# Altium schematic sheet XC95144XL DEVBOARD.SchDoc: XC95144XL DEVBOARD
size 420 x 297 mm; ApprovedBy: .; CheckedBy: .; Author: DiWou; CompanyName: DL2DW; DrawnBy: DiWou; Engineer: DiWou; Organization: DL2DW; DocumentNumber: 1; Revision: -; SheetNumber: 1; SheetTotal: 1; DrawnDate: 24.11.2020; EngrDate: .; ChkdDate: .; Title1: XC95144XL DEVBOARD; Title2: .; Title3: .; Desc1: Version 1.0; Desc2: .; ApprDate: .
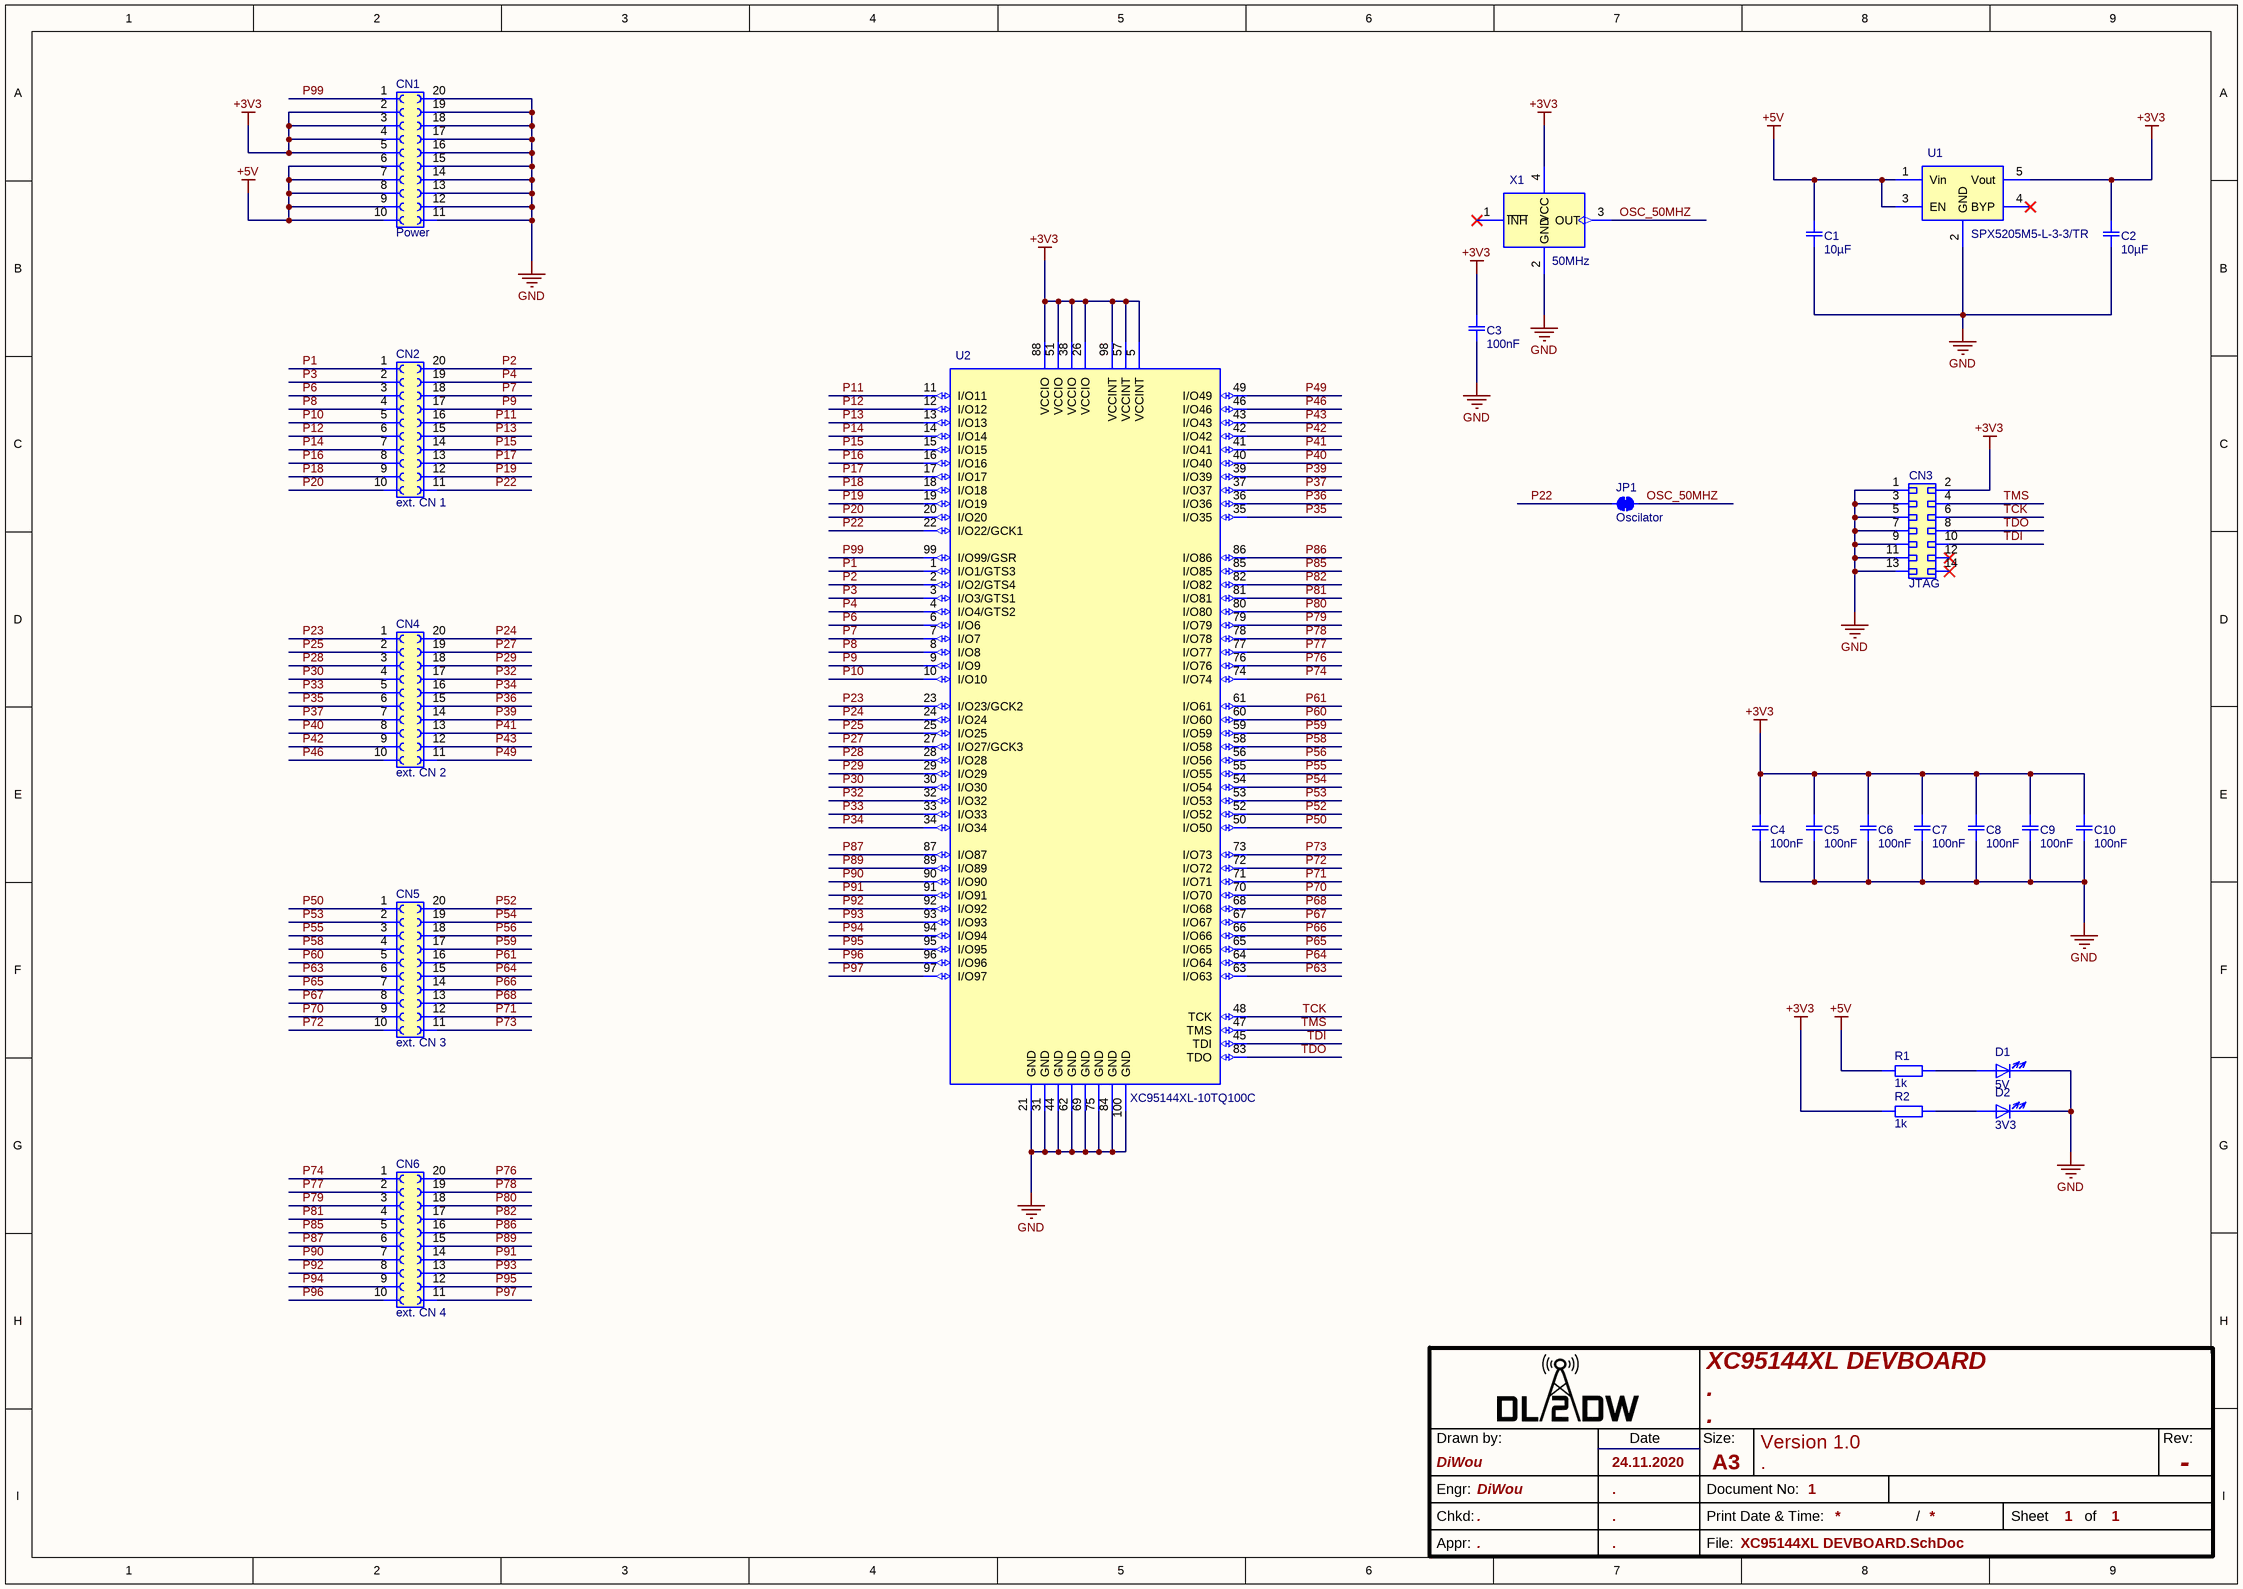
[diagram p0: XC95144XL DEVBOARD.SchDoc]

## Parts
C1  10µF  [Kemet C0805CxxxK8RACTU Series H=1.4mm]
C2  10µF  [Kemet C0805CxxxK8RACTU Series H=1.4mm]
C3  100nF  [CAP 100nF SMD 0603 C0603C104J3RACTU]
C4  100nF  [CAP 100nF SMD 0603 C0603C104J3RACTU]
C5  100nF  [CAP 100nF SMD 0603 C0603C104J3RACTU]
C6  100nF  [CAP 100nF SMD 0603 C0603C104J3RACTU]
C7  100nF  [CAP 100nF SMD 0603 C0603C104J3RACTU]
C8  100nF  [CAP 100nF SMD 0603 C0603C104J3RACTU]
C9  100nF  [CAP 100nF SMD 0603 C0603C104J3RACTU]
C10  100nF  [CAP 100nF SMD 0603 C0603C104J3RACTU]
CN1  Power  [Female Pin Header 02x10 Straight P2.54mm H8.5mm]
CN2  ext. CN 1  [Female Pin Header 02x10 Straight P2.54mm H8.5mm]
CN3  JTAG  [IDC Header 2x7 P2.54mm Straight]
CN4  ext. CN 2  [Female Pin Header 02x10 Straight P2.54mm H8.5mm]
CN5  ext. CN 3  [Female Pin Header 02x10 Straight P2.54mm H8.5mm]
CN6  ext. CN 4  [Female Pin Header 02x10 Straight P2.54mm H8.5mm]
D1  5V  [LED Red SMD 0603]
D2  3V3  [LED Green SMD 0603]
JP1  Oscilator  [Solder Jumper Closed]  (net tie, no BOM)
R1  1k  [1k Ohm R 0603 SMD]
R2  1k  [1k Ohm R 0603 SMD]
U1  SPX5205M5-L-3-3/TR  [SOT-23-5]
U2  XC95144XL-10TQ100C  [TQFP-100 P0.5mm XC95144XL-7TQ100C]
X1  50MHz  [50.000MHZ Oscilator EuroQuartz XO53050UITA]

## Nets
+3V3: C2.2 C3.2 C4.2 C5.2 C6.2 C7.2 C8.2 C9.2 C10.2 CN1.2 CN1.3 CN1.4 CN1.5 CN3.2 R2.1 U1.5(Vout) U2.5(VCCINT) U2.26(VCCIO) U2.38(VCCIO) U2.51(VCCIO) U2.57(VCCINT) U2.88(VCCIO) U2.98(VCCINT) X1.4(VCC)
+5V: C1.2 CN1.6 CN1.7 CN1.8 CN1.9 CN1.10 R1.1 U1.1(Vin) U1.3(EN)
GND: C1.1 C2.1 C3.1 C4.1 C5.1 C6.1 C7.1 C8.1 C9.1 C10.1 CN1.11 CN1.12 CN1.13 CN1.14 CN1.15 CN1.16 CN1.17 CN1.18 CN1.19 CN1.20 CN3.1 CN3.3 CN3.5 CN3.7 CN3.9 CN3.11 CN3.13 D1.1 D2.1 U1.2(GND) U2.21(GND) U2.31(GND) U2.44(GND) U2.62(GND) U2.69(GND) U2.75(GND) U2.84(GND) U2.100(GND) X1.2(GND)
OSC_50MHZ: JP1.2 X1.3(OUT)
P1: CN2.1 U2.1(I/O1/GTS3)
P2: CN2.20 U2.2(I/O2/GTS4)
P3: CN2.2 U2.3(I/O3/GTS1)
P4: CN2.19 U2.4(I/O4/GTS2)
P6: CN2.3 U2.6(I/O6)
P7: CN2.18 U2.7(I/O7)
P8: CN2.4 U2.8(I/O8)
P9: CN2.17 U2.9(I/O9)
P10: CN2.5 U2.10(I/O10)
P11: CN2.16 U2.11(I/O11)
P12: CN2.6 U2.12(I/O12)
P13: CN2.15 U2.13(I/O13)
P14: CN2.7 U2.14(I/O14)
P15: CN2.14 U2.15(I/O15)
P16: CN2.8 U2.16(I/O16)
P17: CN2.13 U2.17(I/O17)
P18: CN2.9 U2.18(I/O18)
P19: CN2.12 U2.19(I/O19)
P20: CN2.10 U2.20(I/O20)
P22: CN2.11 JP1.1 U2.22(I/O22/GCK1)
P23: CN4.1 U2.23(I/O23/GCK2)
P24: CN4.20 U2.24(I/O24)
P25: CN4.2 U2.25(I/O25)
P27: CN4.19 U2.27(I/O27/GCK3)
P28: CN4.3 U2.28(I/O28)
P29: CN4.18 U2.29(I/O29)
P30: CN4.4 U2.30(I/O30)
P32: CN4.17 U2.32(I/O32)
P33: CN4.5 U2.33(I/O33)
P34: CN4.16 U2.34(I/O34)
P35: CN4.6 U2.35(I/O35)
P36: CN4.15 U2.36(I/O36)
P37: CN4.7 U2.37(I/O37)
P39: CN4.14 U2.39(I/O39)
P40: CN4.8 U2.40(I/O40)
P41: CN4.13 U2.41(I/O41)
P42: CN4.9 U2.42(I/O42)
P43: CN4.12 U2.43(I/O43)
P46: CN4.10 U2.46(I/O46)
P49: CN4.11 U2.49(I/O49)
P50: CN5.1 U2.50(I/O50)
P52: CN5.20 U2.52(I/O52)
P53: CN5.2 U2.53(I/O53)
P54: CN5.19 U2.54(I/O54)
P55: CN5.3 U2.55(I/O55)
P56: CN5.18 U2.56(I/O56)
P58: CN5.4 U2.58(I/O58)
P59: CN5.17 U2.59(I/O59)
P60: CN5.5 U2.60(I/O60)
P61: CN5.16 U2.61(I/O61)
P63: CN5.6 U2.63(I/O63)
P64: CN5.15 U2.64(I/O64)
P65: CN5.7 U2.65(I/O65)
P66: CN5.14 U2.66(I/O66)
P67: CN5.8 U2.67(I/O67)
P68: CN5.13 U2.68(I/O68)
P70: CN5.9 U2.70(I/O70)
P71: CN5.12 U2.71(I/O71)
P72: CN5.10 U2.72(I/O72)
P73: CN5.11 U2.73(I/O73)
P74: CN6.1 U2.74(I/O74)
P76: CN6.20 U2.76(I/O76)
P77: CN6.2 U2.77(I/O77)
P78: CN6.19 U2.78(I/O78)
P79: CN6.3 U2.79(I/O79)
P80: CN6.18 U2.80(I/O80)
P81: CN6.4 U2.81(I/O81)
P82: CN6.17 U2.82(I/O82)
P85: CN6.5 U2.85(I/O85)
P86: CN6.16 U2.86(I/O86)
P87: CN6.6 U2.87(I/O87)
P89: CN6.15 U2.89(I/O89)
P90: CN6.7 U2.90(I/O90)
P91: CN6.14 U2.91(I/O91)
P92: CN6.8 U2.92(I/O92)
P93: CN6.13 U2.93(I/O93)
P94: CN6.9 U2.94(I/O94)
P95: CN6.12 U2.95(I/O95)
P96: CN6.10 U2.96(I/O96)
P97: CN6.11 U2.97(I/O97)
P99: CN1.1 U2.99(I/O99/GSR)
TCK: CN3.6 U2.48(TCK)
TDI: CN3.10 U2.45(TDI)
TDO: CN3.8 U2.83(TDO)
TMS: CN3.4 U2.47(TMS)
NetD1_2: D1.2 R1.2
NetD2_2: D2.2 R2.2

Not connected (* = marked no-connect by the designer): CN3 12* 14*; U1 4(BYP)*; X1 1(~{INH})*

## Notes on the sheet
- Drawn by:
- Date
- Size:
- A3
- Rev:
- Engr:
- Chkd:
- Appr:
- File:
- Document No:
- Print Date & Time:
- /
- Sheet
- of

## Library data of the parts
C1 C2 = CMP-Capacitors-Ceramic_Capacitors-00016-2: KEMET - C0805C106K8RACTU - CAP, 10µF, 10V, 10%, X7R, 0805; Dissipation Factor: 7.5%; Capacitance: 10uF; Max Operating Temperature: 125°C; Packaging: Tape and Reel; Case Code (Imperial): 0805; Depth: 1.25mm; Dielectric Material: Ceramic; Voltage: 10V; Voltage Rating (DC): 10V; Mount: Surface Mount,PCB; Min Operating Temperature: -55°C; Case Code (Metric): 2012; Case/Package: 0805; Thickness: 0.055inch; Termination: SMD/SMT; Voltage Rating: 10V; Height: 1.25mm; Dielectric: X7R; Width: 1.2mm; Package Quantity: 1; Length: 2mm; REACH SVHC: No SVHC; Tolerance: 10%
C3-C10 = CMP-Capacitors-Ceramic_Capacitors-00012-1: KEMET         C0603C104J3RACTU             SMD Multilayer Ceramic Capacitor, 0603 [1608 Metric], 0.1 F, 25 V,  5%, X7R, C Series; Voltage Rating (DC): 25V; Height: 0.8mm; Dielectric: X7R; Case Code (Metric): 1608; Width: 0.031inch; Depth: 0.8mm; Min Operating Temperature: -55°C; Number of Pins: 2; Mount: Surface Mount,PCB; REACH SVHC: No SVHC; Packaging: Tape and Reel; Case Code (Imperial): 0603; Contact Plating: Tin,Matte; Length: 1.6mm; Case/Package: 0603; Lead Pitch: 0.7mm; Package Quantity: 4000; Tolerance: 5%; Radiation Hardening: No; Dielectric Material: Ceramic; Voltage: 25V; Termination: SMD/SMT; Capacitance: 100nF; Voltage Rating: 25V; Thickness: 0.034inch; Max Operating Temperature: 125°C
CN1 CN2 CN4-CN6 = CMP-Connectors-Female_Pin_Headers00047-1: Headers & Wire Housings 10+10 VERT SOCKET DIL; Connector Type: Receptacle,Socket; Row Spacing: 0.1inch; Contact Resistance: 20mR; Gender: Female; Pitch: 2.54mm; Number of Contacts: 20; Max Current Rating: 3A; Depth: 5.04mm; Termination: Solder; Mount: Through Hole; Contact Gender: Female; Housing Color: Black; Package Quantity: 23; Number of Rows: 2; Color: Black; Radiation Hardening: No; Packaging: Rail/Tube; Orientation: Straight; Contact Material: Bronze; REACH SVHC: No SVHC; Contact Plating: Gold,Tin; Max Operating Temperature: 105°C; Min Operating Temperature: -40°C; Length: 25.8mm; Number of Positions: 20; Housing Material: Polyamide
CN3 = CMP-Connectors-IDC_Connectors-00028-1: Conn Shrouded Header HDR 14 POS 2.54mm Solder ST Thru-Hole; Row Spacing: 0.1inch; Connector Type: Male Pin; Number of Positions: 14; Gender: Male; REACH SVHC: No SVHC; Package Quantity: 1; Contact Material: Bronze; Packaging: Bulk; Length: 21.59mm; Max Operating Temperature: 125°C; Orientation: Straight; Min Operating Temperature: -55°C; Depth: 9.27mm; Contact Mating Length: 0.25inch; Color: Black; Pitch: 2.54mm; Contact Plating: Gold; Termination: Solder; Mount: Through Hole; Number of Contacts: 14; Housing Material: Polyester; Radiation Hardening: No; Number of Rows: 2; Housing Color: Black
D1 = CMP-LEDs-00005-1: LED RED DIFFUSED 0603 SMD; Viewing Angle: 140°; Dominant Wavelength: 630nm; Luminous Intensity: 70mcd; Forward Voltage: 2V; Test Current: 20mA; Lens Style: Flat; Lens Size: 0.8mm; Lens Transparency: Diffused; Packaging: Tape and Reel; Case/Package: 0603; Case Code (Imperial): 0603; Width: 0.8mm; Length: 1.6mm; Height: 0.5mm; Case Code (Metric): 1608; Color: Red; Mount: Surface Mount
D2 = CMP-LEDs-00004-2: LED BLUE DIFFUSED 0603 SMD; Dominant Wavelength: 470nm; Test Current: 20mA; Lens Style: Flat; Viewing Angle: 140°; Forward Voltage: 3.2V; Lens Size: 0.8mm; Luminous Intensity: 80mcd; Color: Blue; Case/Package: 0603; Mount: Surface Mount; Width: 0.8mm; Lens Transparency: Diffused; Length: 1.6mm; Height: 0.5mm; Packaging: Tape and Reel
JP1 = CMP-Mechanicals-00017-7: Solder Jumper Closed
R1 R2 = CMP-Resistors-Yageo_SMD_060300002-1: RES SMD 1K OHM 1% 1/10W 0603; Power Rating: 100mW; Resistance: 1kR; Voltage Rating: 50V; Temperature Coefficient: 100ppm/°C; Case/Package: 0603; REACH SVHC: No SVHC; Length: 1.6mm; Tolerance: 1%; Case Code (Metric): 1608; Contact Plating: Tin,Matte; Height: 0.45mm; Case Code (Imperial): 0603; Packaging: Tape and Reel; Max Operating Temperature: 155°C; Military Standard: Not; Lead Free: Lead Free; Depth: 0.8mm; Termination: SMD/SMT; Min Operating Temperature: -55°C; Composition: Thick Film; Radiation Hardening: No
U1 = CMP-ICs-Power_Supply-00002-2: LDO Regulator Pos 3.3V 0.15A 5-Pin SOT-23 T/R; Min Input Voltage: 2.5V; Number of Outputs: 1; Dropout Voltage: 210mV; Accuracy: 1%; Polarity: Positive; Max Input Voltage: 16V; Output Type: Fixed; Output Current: 150mA; Quiescent Current: 1uA; Packaging: Tape and Reel; Lead Free: Lead Free; Case/Package: SOT-23; Height: 1.15mm; Number of Regulators: 1; Max Operating Temperature: 125°C; Min Operating Temperature: -40°C; Output Voltage: 3.3V; Width: 1.6mm; Radiation Hardening: No; Mount: Surface Mount; Length: 2.9mm; Max Output Current: 150mA; Min Output Voltage: 3.3V; Number of Pins: 5
U2 = CMP-ICs-CPLD_FPGA-00000-1: IC CPLD 144MC 7.5NS 100TQFP; Speed Grade: 7; Operating Supply Voltage: 3.3V; Max Supply Voltage: 3.6V; Number of Gates: 3200; Min Supply Voltage: 3V; Number of I/Os: 81; Number of Macrocells: 144; Number of Logic Blocks (LABs): 8; Max Frequency: 125MHz; Memory Type: FLASH; Turn-On Delay Time: 7.5ns; Mount: Surface Mount; Number of Pins: 100; Propagation Delay: 7.5ns; Package Quantity: 90; Case/Package: LQFP; Contact Plating: Tin,Lead; Packaging: Tray; Lead Free: Contains Lead; Min Operating Temperature: 0°C; Number of Logic Elements/Cells: 8; Max Operating Temperature: 70°C
X1 = CMP-Crystals_Oscilators-00004-1: XO53050UITA-50.000, Crystal Oscillator, 50 MHz, 50ppm HCMOS, LSTTL 15pF, 4-Pin SMD, 5 x 3.2 x 1mm; Frequency Stability: 50ppm; Case/Package: SMD/SMT; Min Operating Temperature: -40°C; Width: 3.2mm; Height: 1mm; Mount: Surface Mount; Max Operating Temperature: 85°C; Length: 5mm; Number of Pins: 4; Load Capacitance: 15pF